# Altium schematic sheet Sheet1-control.SchDoc
size A3; SheetNumber: 2; SheetTotal: 2
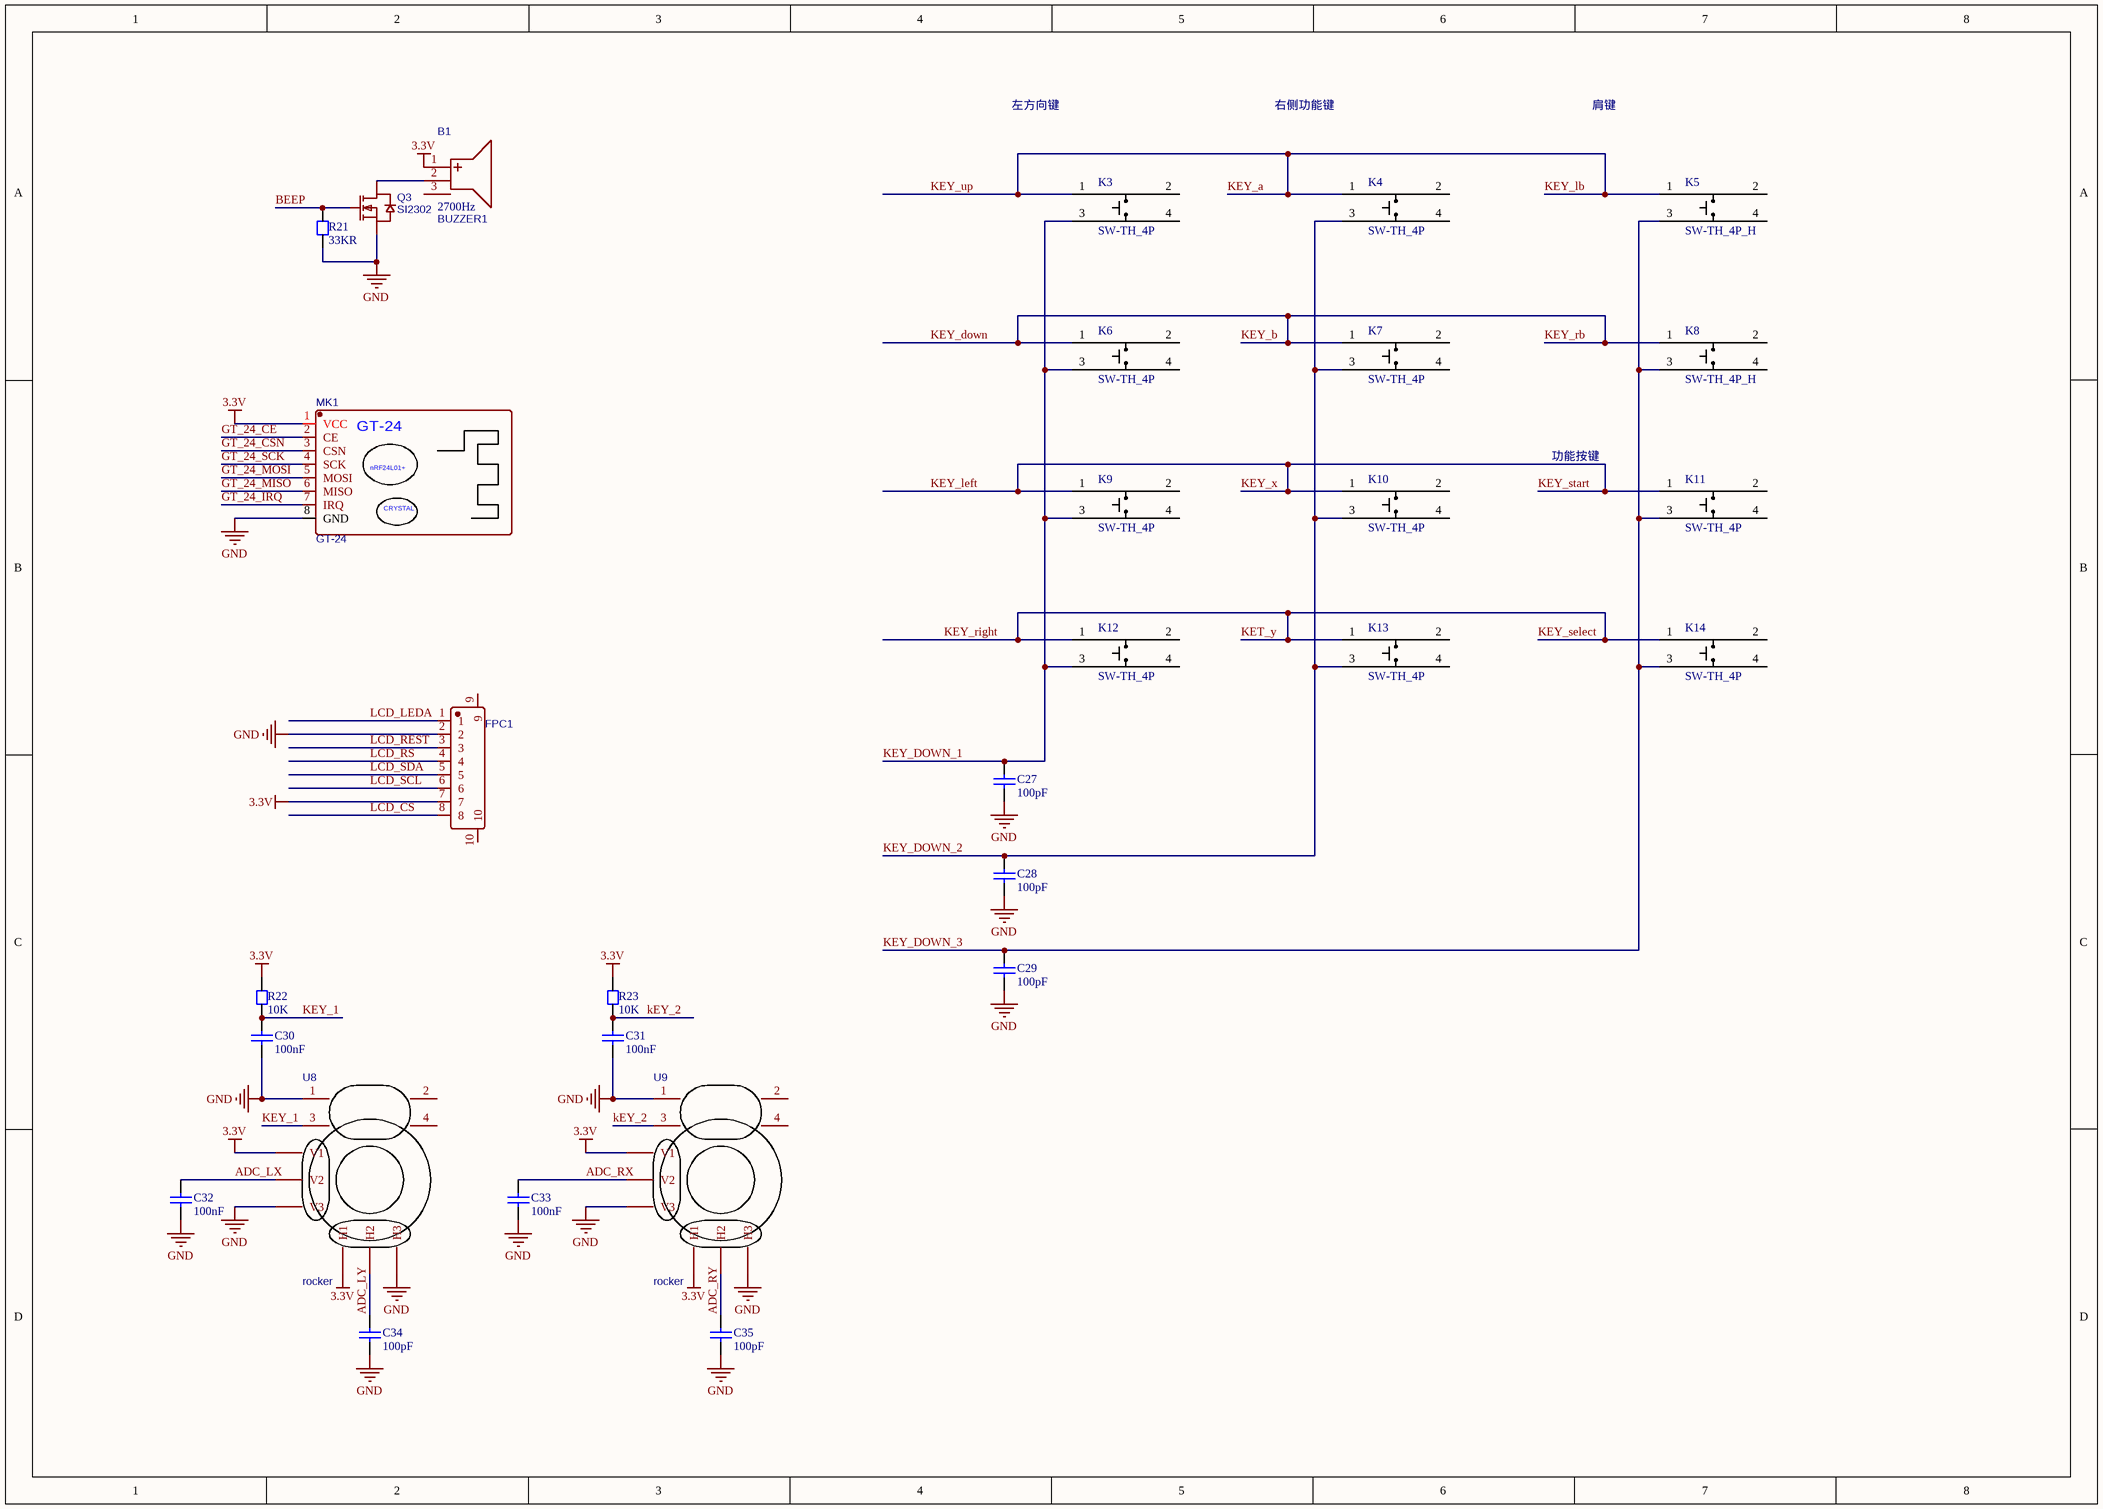
[diagram p0: Sheet1-control.SchDoc]

## Parts
B1  BUZZER1  [BUZ-SMD_GSC7525RA]
C27  100pF  [CC1608-0603]
C28  100pF  [CC1608-0603]
C29  100pF  [CC1608-0603]
C30  100nF  [CC1608-0603]
C31  100nF  [CC1608-0603]
C32  100nF  [CC1608-0603]
C33  100nF  [CC1608-0603]
C34  100pF  [CC1608-0603]
C35  100pF  [CC1608-0603]
FPC1  FFC 05 8P  [FFC-SMD_8P-P0.50]  (value not drawn)
K3  SW-TH_4P  [SW-TH_4P]
K4  SW-TH_4P  [SW-TH_4P]
K5  SW-TH_4P_H  [SW-TH_KH-6X6X7H-ZJ]
K6  SW-TH_4P  [SW-TH_4P]
K7  SW-TH_4P  [SW-TH_4P]
K8  SW-TH_4P_H  [SW-TH_KH-6X6X7H-ZJ]
K9  SW-TH_4P  [SW-TH_4P]
K10  SW-TH_4P  [SW-TH_4P]
K11  SW-TH_4P  [SW-TH_4P]
K12  SW-TH_4P  [SW-TH_4P]
K13  SW-TH_4P  [SW-TH_4P]
K14  SW-TH_4P  [SW-TH_4P]
MK1  GT-24  [WIRELM-SMD_AS01-ML01S]
Q3  SI2302  [SOT-23]
R21  33KR  [CR1608-0603]
R22  10K  [CR1608-0603]
R23  10K  [CR1608-0603]
U8  rocker  [PCBComponent_1]
U9  rocker  [PCBComponent_1]

## Nets
3.3V: B1.1(+) FPC1.7 MK1.1(VCC) R22.2 R23.2 U8.5(V1) U8.8(H1) U9.5(V1) U9.8(H1)
GND: C27.1 C28.1 C29.1 C30.1 C31.1 C32.1 C33.1 C34.1 C35.1 FPC1.2 MK1.8(GND) Q3.2(S) R21.2 U8.1 U8.7(V3) U8.10(H3) U9.1 U9.7(V3) U9.10(H3)
ADC_LX: C32.2 U8.6(V2)
ADC_LY: C34.2 U8.9(H2)
ADC_RX: C33.2 U9.6(V2)
ADC_RY: C35.2 U9.9(H2)
BEEP: Q3.1(G) R21.1
GT_24_CE: MK1.2(CE)
GT_24_CSN: MK1.3(CSN)
GT_24_IRQ: MK1.7(IRQ)
GT_24_MISO: MK1.6(MISO)
GT_24_MOSI: MK1.5(MOSI)
GT_24_SCK: MK1.4(SCK)
KET_y: K12.1 K13.1 K14.1  [also labelled KEY_right, KEY_select]
KEY_1: C30.2 R22.1 U8.3
kEY_2: C31.2 R23.1 U9.3
KEY_a: K3.1 K4.1 K5.1  [also labelled KEY_lb, KEY_up]
KEY_b: K6.1 K7.1 K8.1  [also labelled KEY_down, KEY_rb]
KEY_DOWN_1: C27.2 K3.3 K6.3 K9.3 K12.3
KEY_DOWN_2: C28.2 K4.3 K7.3 K10.3 K13.3
KEY_DOWN_3: C29.2 K5.3 K8.3 K11.3 K14.3
KEY_left: K9.1 K10.1 K11.1  [also labelled KEY_start, KEY_x]
LCD_CS: FPC1.8
LCD_LEDA: FPC1.1
LCD_REST: FPC1.3
LCD_RS: FPC1.4
LCD_SCL: FPC1.6
LCD_SDA: FPC1.5
NetB1_2: B1.2(-) Q3.3(D)

Not connected (* = marked no-connect by the designer): B1 3(EH); FPC1 9 10; K3 2 4; K4 2 4; K5 2 4; K6 2 4; K7 2 4; K8 2 4; K9 2 4; K10 2 4; K11 2 4; K12 2 4; K13 2 4; K14 2 4; U8 2 4; U9 2 4

## Notes on the sheet
- 左方向键
- 右侧功能键
- 肩键
- 功能按键
- (in symbol GT-24) nRF24L01+; CRYSTAL

## Library data of the parts
B1 = BUZZER1: 2700Hz; Manufacturer: INGHAi(赢海); Manufacturer Part: GSC7525RA-16R2700; Contributor: LCSC; nameAlias: Value; Supplier: LCSC; Supplier Part: C255313; spicePre: B; spiceSymbolName: GSC7525RA-16R2700
C27-C35 = Cap Chip 0603: 0603封装的电容; Published: 8-Jun-2000; Revision: July-2002: Re-released for DXP Platform.; Publisher: Altium Limited
FPC1 = FFC 05 8P: Manufacturer: TXGA(特思嘉); Manufacturer Part: FFC05001-08SBB124W5M-H; Contributor: LCSC; Supplier: LCSC; Supplier Part: C456420; JLCPCB Part Class: Extended Part; spicePre: F; spiceSymbolName: FFC05001-08SBB124W5M-H
K3 K4 K6 K7 K9-K14 = SW-TH_4P: 轻触开关
K5 K8 = SW-TH_4P_H: 卧式轻触开关
MK1 = GT-24: 工业级GT-24数传无线模块 2.4G NRF24L01&PA+LNA; Manufacturer: Ashining(泽耀科技); Manufacturer Part: AS01-ML01S; Supplier: LCSC; Supplier Part: C84802; JLCPCB Part Class: Extended Part; spicePre: M; spiceSymbolName: AS01-ML01S
Q3 = SI2302: N沟道 / 漏源电压(Vdss) 20V / 连续漏极电流(Id) 2.8A / 功率(Pd) 900mW / 导通电阻(RDS(on)@Vgs,Id) 55mΩ@4.5V,2.8A / 阈值电压(Vgs(th)@Id) 1.2V@250uA / 输入电容(Ciss@Vds) 260pF@10V; Manufacturer: TWGMC(台湾迪嘉); Manufacturer Part: SI2306; Contributor: LCSC; Supplier: LCSC; Supplier Part: C727154; JLCPCB Part Class: Extended Part; spicePre: Q; spiceSymbolName: SI2306_C727154
R21 = Chip resistor: 贴片电阻
R22 R23 = Resistor Chip 0603: 0603封装电阻; Published: 8-Jun-2000; Revision: July-2002: Re-released for DXP Platform.; Publisher: Altium Limited
U8 U9 = rocker: Manufacturer Part: 摇杆; Contributor: Alex_Ai; spicePre: U; spiceSymbolName: 摇杆_直插_圆半径13_10电气脚_4固定脚 COPY